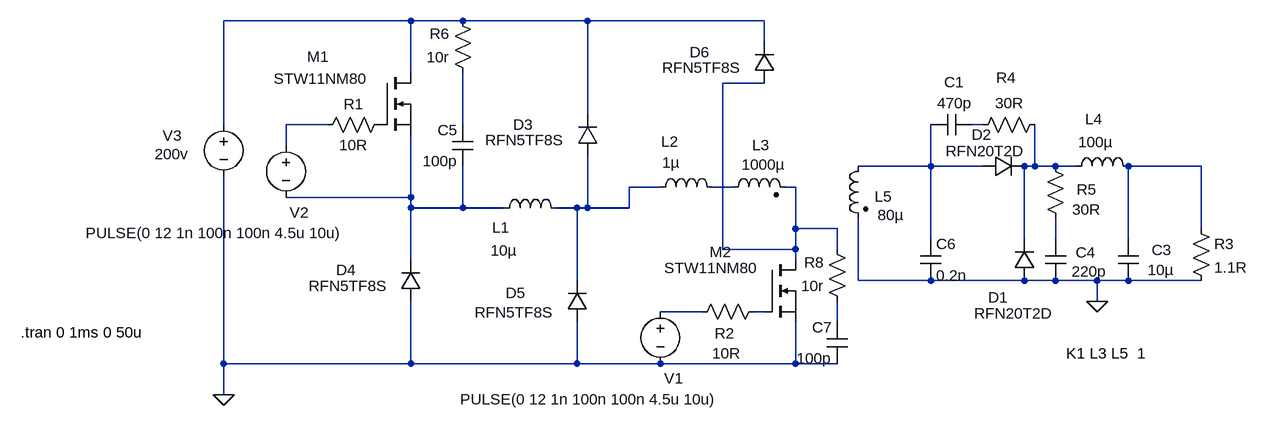
[diagram p0: schematic 主回路仿真.asc]
主回路仿真.asc, the LTspice schematic file:
Version 4
SHEET 1 1792 1032
WIRE 256 -256 -32 -256
WIRE 336 -256 256 -256
WIRE 528 -256 336 -256
WIRE 800 -256 528 -256
WIRE 800 -224 800 -256
WIRE 256 -176 256 -256
WIRE 800 -160 736 -160
WIRE 528 -112 528 -256
WIRE -32 -96 -32 -256
WIRE 128 -96 64 -96
WIRE 336 -96 336 -176
WIRE 1136 -96 1120 -96
WIRE 64 -64 64 -96
WIRE 1056 -32 1056 -96
WIRE 1056 -32 944 -32
WIRE 1136 -32 1056 -32
WIRE 1216 -32 1216 -96
WIRE 1216 -32 1200 -32
WIRE 1248 -32 1216 -32
WIRE 1280 -32 1248 -32
WIRE 1472 -32 1360 -32
WIRE 640 0 592 0
WIRE 752 0 720 0
WIRE 848 0 832 0
WIRE 256 16 256 -80
WIRE 256 16 64 16
WIRE 256 32 256 16
WIRE 336 32 336 -32
WIRE 336 32 256 32
WIRE 400 32 336 32
WIRE 512 32 480 32
WIRE 528 32 528 -48
WIRE 528 32 512 32
WIRE 592 32 592 0
WIRE 592 32 528 32
WIRE 848 64 848 0
WIRE 912 64 848 64
WIRE 1472 64 1472 -32
WIRE 1056 80 1056 -32
WIRE 1200 80 1200 -32
WIRE 1248 80 1248 48
WIRE 1360 80 1360 -32
WIRE 736 96 736 -160
WIRE 848 96 848 64
WIRE 848 96 736 96
WIRE 912 96 912 64
WIRE 256 112 256 32
WIRE 848 112 848 96
WIRE 512 144 512 32
WIRE 944 144 944 48
WIRE 1056 144 944 144
WIRE 1200 144 1056 144
WIRE 1248 144 1200 144
WIRE 1312 144 1248 144
WIRE 1360 144 1312 144
WIRE 1472 144 1360 144
WIRE 1312 176 1312 144
WIRE 704 192 640 192
WIRE 800 192 784 192
WIRE 912 208 912 176
WIRE -32 272 -32 -16
WIRE 256 272 256 176
WIRE 256 272 -32 272
WIRE 512 272 512 208
WIRE 512 272 256 272
WIRE 640 272 512 272
WIRE 848 272 848 208
WIRE 848 272 640 272
WIRE 912 272 848 272
WIRE -32 320 -32 272
FLAG 1312 176 0
FLAG -32 320 0
SYMBOL ind 384 48 R270
WINDOW 0 -30 11 VTop 2
WINDOW 3 -34 15 VBottom 2
SYMATTR InstName L1
SYMATTR Value 10µ
SYMBOL nmos 208 -176 R0
WINDOW 0 -111 -25 Left 2
WINDOW 3 -18 9 Right 2
SYMATTR InstName M1
SYMATTR Value STW11NM80
SYMBOL voltage 64 -80 R0
WINDOW 3 -308 151 Left 2
WINDOW 123 0 0 Left 2
WINDOW 39 0 0 Left 2
WINDOW 0 6 119 Left 2
SYMATTR Value PULSE(0 12 1n 100n 100n 4.5u 10u)
SYMATTR InstName V2
SYMBOL res 224 -112 R90
WINDOW 0 0 56 VBottom 2
WINDOW 3 32 56 VTop 2
SYMATTR InstName R1
SYMATTR Value 10R
SYMBOL res 800 176 R90
WINDOW 0 65 61 VBottom 2
WINDOW 3 65 58 VTop 2
SYMATTR InstName R2
SYMATTR Value 10R
SYMBOL ind 624 16 R270
WINDOW 0 70 31 VTop 2
WINDOW 3 69 32 VBottom 2
SYMATTR InstName L2
SYMATTR Value 1µ
SYMBOL ind2 736 16 R270
WINDOW 0 65 59 VTop 2
WINDOW 3 66 63 VBottom 2
SYMATTR InstName L3
SYMATTR Value 1000µ
SYMATTR Type ind
SYMBOL cap 1120 -112 R90
WINDOW 0 -34 28 VBottom 2
WINDOW 3 -33 27 VTop 2
SYMATTR InstName C1
SYMATTR Value 470p
SYMBOL voltage -32 -112 R0
WINDOW 123 0 0 Left 2
WINDOW 39 0 0 Left 2
WINDOW 0 -94 33 Left 2
WINDOW 3 -106 61 Left 2
SYMATTR InstName V3
SYMATTR Value 200v
SYMBOL ind2 960 -48 M0
WINDOW 0 -37 63 Left 2
WINDOW 3 -55 91 Left 2
SYMATTR InstName L5
SYMATTR Value 80µ
SYMATTR Type ind
SYMBOL diode 1216 144 R180
WINDOW 0 41 -26 Left 2
WINDOW 3 -29 -51 Left 2
SYMATTR InstName D1
SYMATTR Value RFN20T2D
SYMBOL diode 1136 -16 R270
WINDOW 0 49 -2 VTop 2
WINDOW 3 55 4 VBottom 2
SYMATTR InstName D2
SYMATTR Value RFN20T2D
SYMBOL cap 1344 80 R0
WINDOW 0 52 17 Left 2
WINDOW 3 46 48 Left 2
SYMATTR InstName C3
SYMATTR Value 10µ
SYMBOL res 1456 48 R0
SYMATTR InstName R3
SYMATTR Value 1.1R
SYMBOL nmos 800 112 R0
WINDOW 0 -84 -12 Left 2
WINDOW 3 -9 13 Right 2
SYMATTR InstName M2
SYMATTR Value STW11NM80
SYMBOL diode 544 -48 R180
WINDOW 0 100 48 Left 2
WINDOW 3 51 24 Left 2
SYMATTR InstName D3
SYMATTR Value RFN5TF8S
SYMBOL diode 528 208 R180
WINDOW 0 95 45 Left 2
WINDOW 3 51 15 Left 2
SYMATTR InstName D5
SYMATTR Value RFN5TF8S
SYMBOL res 1232 -112 R90
WINDOW 0 -41 60 VBottom 2
WINDOW 3 -33 55 VTop 2
SYMATTR InstName R4
SYMATTR Value 30R
SYMBOL cap 1264 144 R180
WINDOW 0 -46 43 Left 2
WINDOW 3 -63 14 Left 2
SYMATTR InstName C4
SYMATTR Value 220p
SYMBOL res 1264 64 R180
WINDOW 0 -47 60 Left 2
WINDOW 3 -54 29 Left 2
SYMATTR InstName R5
SYMATTR Value 30R
SYMBOL voltage 640 176 R0
WINDOW 3 -308 151 Left 2
WINDOW 123 0 0 Left 2
WINDOW 39 0 0 Left 2
WINDOW 0 6 119 Left 2
SYMATTR Value PULSE(0 12 1n 100n 100n 4.5u 10u)
SYMATTR InstName V1
SYMBOL ind 1264 -16 R270
WINDOW 0 73 43 VTop 2
WINDOW 3 69 46 VBottom 2
SYMATTR InstName L4
SYMATTR Value 100µ
SYMBOL diode 272 176 R180
WINDOW 0 100 48 Left 2
WINDOW 3 51 24 Left 2
SYMATTR InstName D4
SYMATTR Value RFN5TF8S
SYMBOL diode 816 -160 R180
WINDOW 0 100 48 Left 2
WINDOW 3 51 24 Left 2
SYMATTR InstName D6
SYMATTR Value RFN5TF8S
SYMBOL res 352 -160 R180
WINDOW 0 36 76 Left 2
WINDOW 3 36 40 Left 2
SYMATTR InstName R6
SYMATTR Value 10r
SYMBOL cap 352 -32 R180
WINDOW 0 24 56 Left 2
WINDOW 3 24 8 Left 2
SYMATTR InstName C5
SYMATTR Value 100p
SYMBOL cap 1040 80 R0
SYMATTR InstName C6
SYMATTR Value 0.2n
SYMBOL res 928 192 R180
WINDOW 0 36 76 Left 2
WINDOW 3 36 40 Left 2
SYMATTR InstName R8
SYMATTR Value 10r
SYMBOL cap 928 272 R180
WINDOW 0 24 56 Left 2
WINDOW 3 24 8 Left 2
SYMATTR InstName C7
SYMATTR Value 100p
TEXT 1264 256 Left 2 !K1 L3 L5  1
TEXT -344 224 Left 2 !.tran 0 1ms 0 50u

The netlist it stands for:
* 主回路仿真.asc
L1 N011 N009 10µ
M1 N001 P001 N011 N011 STW11NM80
V2 N003 N011 PULSE(0 12 1n 100n 100n 4.5u 10u)
R1 P001 N003 10R
R2 N014 N013 10R
L2 N009 N010 1µ
L3 N010 N002 1000µ
C1 N005 N006 470p
V3 N001 0 200v
L5 N006 0 80µ
D1 0 N007 RFN20T2D
D2 N006 N007 RFN20T2D
C3 N008 0 10µ
R3 N008 0 1.1R
M2 N002 N014 0 0 STW11NM80
D3 N009 N001 RFN5TF8S
D5 0 N009 RFN5TF8S
R4 N007 N005 30R
C4 0 N012 220p
R5 N012 N007 30R
V1 N013 0 PULSE(0 12 1n 100n 100n 4.5u 10u)
L4 N007 N008 100µ
D4 0 N011 RFN5TF8S
D6 N002 N001 RFN5TF8S
R6 N004 N001 10r
C5 N011 N004 100p
C6 N006 0 0.2n
R8 N015 N002 10r
C7 0 N015 100p
.model D D
.lib standard.dio
.model NMOS NMOS
.model PMOS PMOS
.lib standard.mos
K1 L3 L5  1
.tran 0 1ms 0 50u
.backanno
.end